# Altium project Flyback181222.PrjPcb
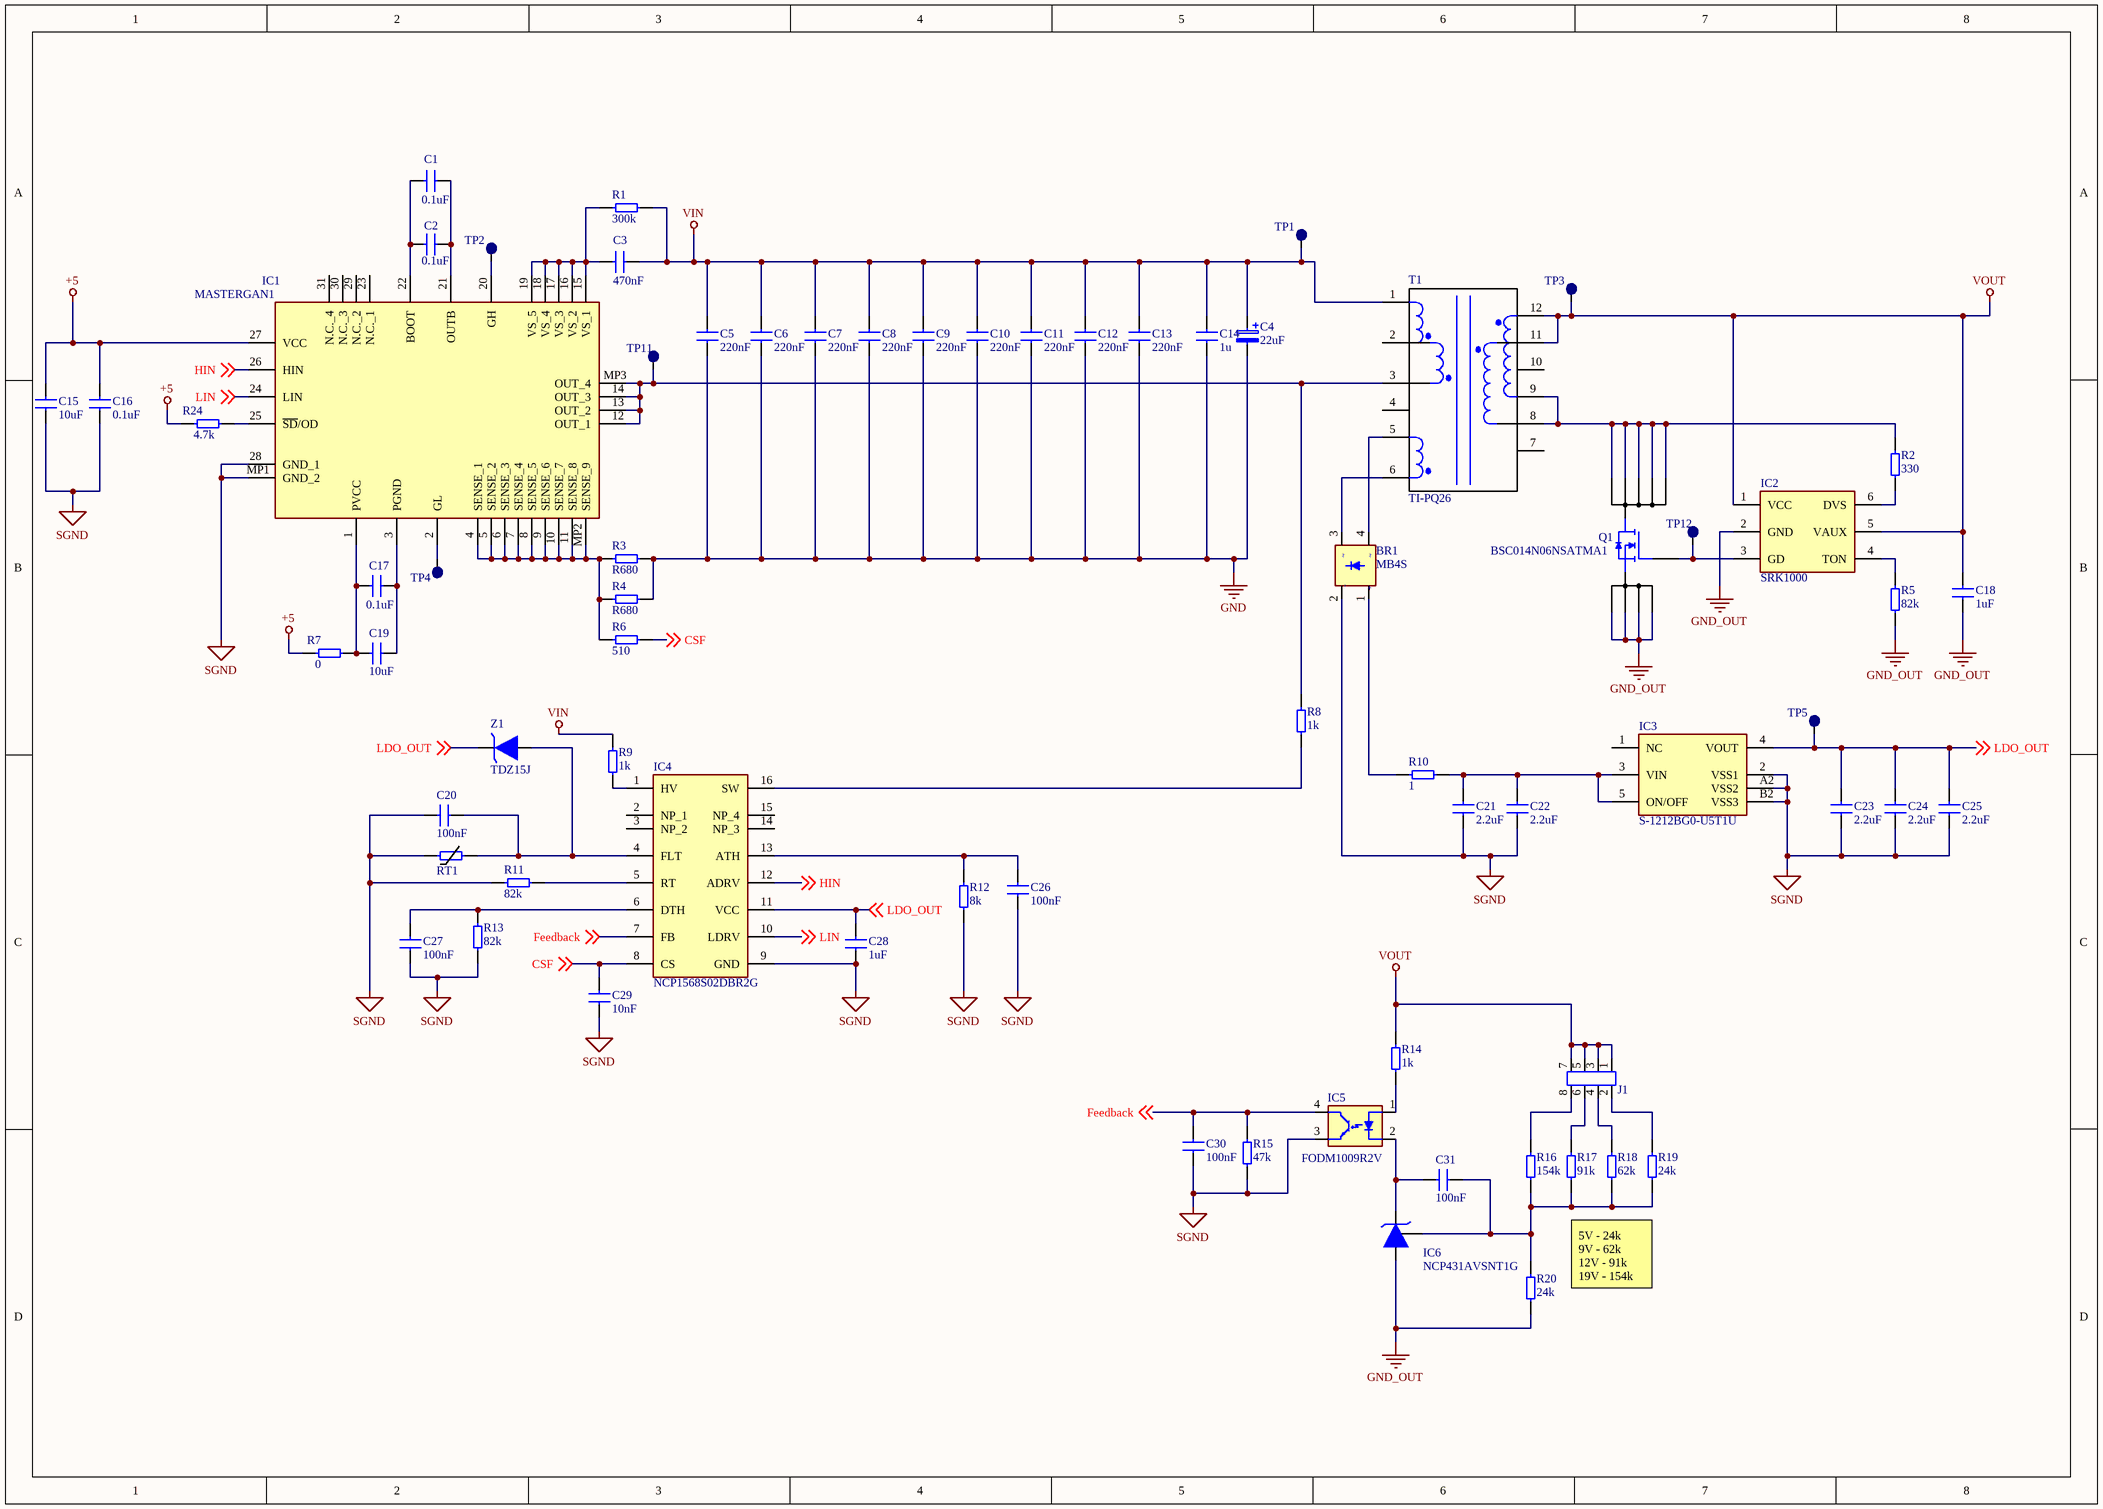
[diagram p0: main.SchDoc]
2 sheets, 102 parts. Net scope: global (net labels, ports and power ports of the same name join across sheets).
Board file: ACF_PCB.PcbDoc
Sheets:
  main.SchDoc
  in_out.SchDoc

## Sheet main.SchDoc
size A3; SheetNumber: 1; SheetTotal: 2; SPICEModelCacheMEYVGTNN: <root> / <DocumentId>MEYVGTNN</DocumentId> / </root>

### Parts
BR1  MB4S  [SOP245P670X290-4N]
C1  0.1uF  [Capcitor_1206]
C2  0.1uF  [Capcitor_1206]
C3  470nF  [Capacitor_1812]
C4  22uF  [CAPPRD500W60D1300H2700]
C5  220nF  [Capacitor_1812]
C6  220nF  [Capacitor_1812]
C7  220nF  [Capacitor_1812]
C8  220nF  [Capacitor_1812]
C9  220nF  [Capacitor_1812]
C10  220nF  [Capacitor_1812]
C11  220nF  [Capacitor_1812]
C12  220nF  [Capacitor_1812]
C13  220nF  [Capacitor_1812]
C14  1u  [TDKB58031]
C15  10uF  [Capcitor_1206]
C16  0.1uF  [Capcitor_1206]
C17  0.1uF  [Capcitor_1206]
C18  1uF  [Capcitor_1206]
C19  10uF  [Capcitor_1206]
C20  100nF  [Capcitor_1206]
C21  2.2uF  [Capcitor_1206]
C22  2.2uF  [Capcitor_1206]
C23  2.2uF  [Capcitor_1206]
C24  2.2uF  [Capcitor_1206]
C25  2.2uF  [Capcitor_1206]
C26  100nF  [Capcitor_1206]
C27  100nF  [Capcitor_1206]
C28  1uF  [Capacitor_0805]
C29  10nF  [Capcitor_1206]
C30  100nF  [Capcitor_1206]
C31  100nF  [Capcitor_1206]
IC1  MASTERGAN1  [MASTERGAN1]
IC2  SRK1000  [SOT95P280X145-6N]
IC3  S-1212BG0-U5T1U  [S1212BG0U5T1U]
IC4  NCP1568S02DBR2G  [SOIC127P600X175-16N]
IC5  FODM1009R2V  [FODM1009R2V]
IC6  NCP431AVSNT1G  [SOT96P237X111-3N]
J1  Header_2x4  [Header_2x4]  (value not drawn)
Q1  BSC014N06NSATMA1  [BSC010N04LS6ATMA1]
R1  300k  [Resistor_1206]
R2  330  [Resistor_1206]
R3  R680  [Resistor_1206]
R4  R680  [Resistor_1206]
R5  82k  [Resistor_1206]
R6  510  [Resistor_1206]
R7  0  [Resistor_0805]
R8  1k  [Resistor_1206]
R9  1k  [Resistor_1206]
R10  1  [Resistor_1206]
R11  82k  [Resistor_1206]
R12  8k  [Resistor_1206]
R13  82k  [Resistor_1206]
R14  1k  [Resistor_1206]
R15  47k  [Resistor_1206]
R16  154k  [Resistor_0805]
R17  91k  [Resistor_0805]
R18  62k  [Resistor_0805]
R19  24k  [Resistor_0805]
R20  24k  [Resistor_1206]
R24  4.7k  [Resistor_0805]
RT1  NTCG104EF104FT1SX  [THRMC1005X55N]  (value not drawn)
T1  TI-PQ26  [PQ26-20-K]
TP1  Test point  [Test point]  (value not drawn)  (no BOM)
TP2  Test point  [Test point]  (value not drawn)  (no BOM)
TP3  Test point  [Test point]  (value not drawn)  (no BOM)
TP4  Test point  [Test point]  (value not drawn)  (no BOM)
TP5  Test point  [Test point]  (value not drawn)  (no BOM)
TP11  Test point  [Test point]  (value not drawn)  (no BOM)
TP12  Test point  [Test point]  (value not drawn)  (no BOM)
Z1  TDZ15J  [SODFL4725X105N]

### Nets
+5: C15.2 C16.1 IC1.27(VCC) R7.1 R24.1
GND: C4.2 C5.1 C6.2 C7.1 C8.2 C9.1 C10.2 C11.2 C12.1 C13.2 C14.2 R3.2 R4.2
GND_OUT: C18.1 IC2.2(GND) IC6.3(A) Q1.1(S_1) Q1.2(S_2) Q1.3(S_3) Q1.10(S_4) R5.1 R20.1
SGND: BR1.2 C15.1 C16.2 C20.1 C21.1 C22.1 C23.1 C24.1 C25.1 C26.1 C27.2 C28.1 C29.2 C30.1 IC1.28(GND_1) IC1.MP1(GND_2) IC3.2(VSS1) IC3.A2(VSS2) IC3.B2(VSS3) IC4.9(GND) IC5.3(E) R11.2 R12.1 R13.2 R15.1 RT1.1
VIN: C3.2 C4.1 C5.2 C6.1 C7.2 C8.1 C9.2 C10.1 C11.1 C12.2 C13.1 C14.1 R1.2 R9.2 T1.1 TP1.1
VOUT: C18.2 IC2.1(VCC) IC2.5(VAUX) J1.1 J1.3 J1.5 J1.7 R14.2 T1.11 T1.12 TP3.1
CSF: C29.1 IC4.8(CS) R6.1 ; off-sheet CSF
Feedback: C30.2 IC4.7(FB) IC5.4(C) R15.2 ; off-sheet Feedback
HIN: IC1.26(HIN) IC4.12(ADRV) ; off-sheet HIN
LDO_OUT: C23.2 C24.2 C25.2 C28.2 IC3.4(VOUT) IC4.11(VCC) TP5.1 Z1.1(K) ; off-sheet LDO_OUT
LIN: IC1.24(LIN) IC4.10(LDRV) ; off-sheet LIN
NetBR1_1: BR1.1 R10.1
NetBR1_3: BR1.3 T1.6
NetBR1_4: BR1.4 T1.5
NetC1_1: C1.1 C2.1 IC1.22(BOOT)
NetC1_2: C1.2 C2.2 IC1.21(OUTB)
NetC3_1: C3.1 IC1.15(VS_1) IC1.16(VS_2) IC1.17(VS_3) IC1.18(VS_4) IC1.19(VS_5) R1.1
NetC17_1: C17.1 C19.1 IC1.1(PVCC) R7.2
NetC17_2: C17.2 C19.2 IC1.3(PGND)
NetC20_2: C20.2 IC4.4(FLT) RT1.2 Z1.2(A)
NetC21_2: C21.2 C22.2 IC3.3(VIN) IC3.5(ON/OFF) R10.2
NetC26_2: C26.2 IC4.13(ATH) R12.2
NetC27_1: C27.1 IC4.6(DTH) R13.1
NetC31_1: C31.1 IC5.2(K) IC6.2(K)
NetC31_2: C31.2 IC6.1(REF) R16.1 R17.1 R18.1 R19.1 R20.2
NetIC1_2: IC1.2(GL) TP4.1
NetIC1_4: IC1.4(SENSE_1) IC1.5(SENSE_2) IC1.6(SENSE_3) IC1.7(SENSE_4) IC1.8(SENSE_5) IC1.9(SENSE_6) IC1.10(SENSE_7) IC1.11(SENSE_8) IC1.MP2(SENSE_9) R3.1 R4.1 R6.2
NetIC1_12: IC1.12(OUT_1) IC1.13(OUT_2) IC1.14(OUT_3) IC1.MP3(OUT_4) R8.2 T1.3 TP11.1
NetIC1_20: IC1.20(GH) TP2.1
NetIC1_25: IC1.25(~{SD}/OD) R24.2
NetIC2_3: IC2.3(GD) Q1.4(G) TP12.1
NetIC2_4: IC2.4(TON) R5.2
NetIC2_6: IC2.6(DVS) R2.1
NetIC4_1: IC4.1(HV) R9.1
NetIC4_5: IC4.5(RT) R11.1
NetIC4_16: IC4.16(SW) R8.1
NetIC5_1: IC5.1(A) R14.1
NetJ1_2: J1.2 R19.2
NetJ1_4: J1.4 R18.2
NetJ1_6: J1.6 R17.2
NetJ1_8: J1.8 R16.2
NetQ1_5: Q1.5(D_1) Q1.6(D_2) Q1.7(D_3) Q1.8(D_4) Q1.9(D_5) R2.2 T1.8 T1.9

Not connected (* = marked no-connect by the designer): IC1 23(N.C._1) 29(N.C._2) 30(N.C._3) 31(N.C._4); IC3 1(NC); IC4 2(NP_1) 3(NP_2) 14(NP_3) 15(NP_4); T1 2 4 7 10

### Notes on the sheet
- 5V - 24k
  9V - 62k
  12V - 91k
  19V - 154k
- (in symbol MB4S) ~; -; +

### Library data of the parts
BR1 = MB4S: Bridge Rectifier; Manufacturer_Name: onsemi; Datasheet Link: http://www.onsemi.com/pub/Collateral/MB8S-D.PDF; Height: 2.9mm; Manufacturer_Part_Number: MB4S; Mouser Part Number: 512-MB4S; Mouser Price/Stock: https://www.mouser.co.uk/ProductDetail/onsemi-Fairchild/MB4S?qs=DPwKKv7J1fyzyqMN%2FwPoFQ%3D%3D; Arrow Part Number: MB4S; Arrow Price/Stock: https://www.arrow.com/en/products/mb4s/on-semiconductor?region=europe
C1 C2 = Capacitor_1206: Capacitor - Standard SMD; Voltage: 25V; Capacitance: 0.1uF; MPN: *
C3 = Capacitor_1812: Capacitor - Standard SMD; MPN: CGA8N4X7T2W474K230KA; Voltage: 450V; Capacitance: 470nF
C4 = Capacitor_Electrolytic_THT: Capacitor - Electrolytic  THT; MPN: ESH226M500AL4AA; Voltage: 500V; Capacitance: 22uF
C5-C13 = Capacitor_1812: Capacitor - Standard SMD; MPN: C1812C224MCRACTU; Voltage: 500; Capacitance: 220nF
C14 = Capacitor_1206: Capacitor - Standard SMD; MPN: 1206B104K451CT; Capacitance: 100nF; Voltage: 450V
C15-C17 C19 = Capacitor_1206: Capacitor - Standard SMD; Voltage: 16V; MPN: *
  C15 C19: Capacitance: 10uF
  C16 C17: Capacitance: 0.1uF
C18 = Capacitor_1206: Capacitor - Standard SMD; MPN: CL31B105KBHNFNE; Voltage: 50; Capacitance: 1uF
C20 C26 C27 C29-C31 = Capacitor_1206: Capacitor - Standard SMD; Voltage: 50V; MPN: *
  C20 C26 C27 C30 C31: Capacitance: 100nF
  C29: Capacitance: 10nF
C21-C25 = Capacitor_1206: Capacitor - Standard SMD; MPN: CL31B225KBHNFNE; Voltage: 50V; Capacitance: 2.2uF
C28 = Capacitor_0805: Capacitor - Standard SMD; Voltage: 25V; Capacitance: 1uF; MPN: *
IC1 = MASTERGAN1: Integrated Circuit; Manufacturer_Name: STMicroelectronics; Datasheet Link: https://www.mouser.com/datasheet/2/389/mastergan1-1893186.pdf; Height: 1mm; Manufacturer_Part_Number: MASTERGAN1; Mouser Part Number: 511-MASTERGAN1; Mouser Price/Stock: https://www.mouser.co.uk/ProductDetail/STMicroelectronics/MASTERGAN1?qs=hWgE7mdIu5TUQlvSzk235A%3D%3D; Arrow Part Number: MASTERGAN1; Arrow Price/Stock: https://www.arrow.com/en/products/mastergan1/stmicroelectronics?region=nac
IC2 = SRK1000: Integrated Circuit; Manufacturer_Name: STMicroelectronics; Datasheet Link: https://www.st.com/resource/en/datasheet/srk1000.pdf; Height: 1.45mm; Manufacturer_Part_Number: SRK1000; Mouser Part Number: 511-SRK1000; Mouser Price/Stock: https://www.mouser.co.uk/ProductDetail/STMicroelectronics/SRK1000?qs=byeeYqUIh0P1pUk%2FLXsjaA%3D%3D; Arrow Part Number: SRK1000; Arrow Price/Stock: https://www.arrow.com/en/products/srk1000/stmicroelectronics
IC3 = S-1212BG0-U5T1U: Integrated Circuit; Manufacturer_Name: ABLIC Inc.; Datasheet Link: https://www.mouser.com/datasheet/2/360/S1212B_D_E-1480071.pdf; Height: 1.6mm; Manufacturer_Part_Number: S-1212BG0-U5T1U; Mouser Part Number: 628-S-1212BG0-U5T1U; Mouser Price/Stock: https://www.mouser.co.uk/ProductDetail/ABLIC/S-1212BG0-U5T1U?qs=PqoDHHvF648vInS7ukjfAw%3D%3D
IC4 = NCP1568S02DBR2G: Integrated Circuit; Manufacturer_Name: onsemi; Datasheet Link: https://datasheet.datasheetarchive.com/originals/distributors/Datasheets_SAMA/e6c73cfd9b14743cc4dd16ca5df3e455.pdf; Height: 1.35mm; Manufacturer_Part_Number: NCP1568S02DBR2G; Mouser Part Number: 863-NCP1568S02DBR2G; Mouser Price/Stock: https://www.mouser.co.uk/ProductDetail/onsemi/NCP1568S02DBR2G?qs=BJlw7L4Cy7%252Bni9d8vX6s0A%3D%3D; Arrow Part Number: NCP1568S02DBR2G; Arrow Price/Stock: https://www.arrow.com/en/products/ncp1568s02dbr2g/on-semiconductor?region=nac
IC5 = FODM1009R2V: Integrated Circuit; Manufacturer_Name: onsemi; Datasheet Link: https://componentsearchengine.com/Datasheets/1/FODM1009R2V.pdf; Height: 2.4mm; Manufacturer_Part_Number: FODM1009R2V; Mouser Part Number: 863-FODM1009R2V; Mouser Price/Stock: https://www.mouser.co.uk/ProductDetail/onsemi/FODM1009R2V?qs=d0WKAl%252BL4Kbb4VetG0t5Tw%3D%3D; Arrow Part Number: FODM1009R2V; Arrow Price/Stock: https://www.arrow.com/en/products/fodm1009r2v/on-semiconductor?region=nac
IC6 = NCP431AVSNT1G: Programmable Precision / Reference; Manufacturer_Name: onsemi; Datasheet Link: http://www.onsemi.com/pub/Collateral/NCP431-D.PDF; Height: 1.11mm; Manufacturer_Part_Number: NCP431AVSNT1G; Mouser Part Number: 863-NCP431AVSNT1G; Mouser Price/Stock: https://www.mouser.com/Search/Refine.aspx?Keyword=863-NCP431AVSNT1G; Arrow Part Number: NCP431AVSNT1G; Arrow Price/Stock: https://www.arrow.com/en/products/ncp431avsnt1g/on-semiconductor
Q1 = BSC014N06NSATMA1: MOSFET (N-Channel); Manufacturer_Name: Infineon; Datasheet Link: http://www.farnell.com/datasheets/1849651.html; Height: 1.1mm; Manufacturer_Part_Number: BSC014N06NSATMA1; Mouser Part Number: 726-BSC014N06NSATMA1; Mouser Price/Stock: https://www.mouser.co.uk/ProductDetail/Infineon-Technologies/BSC014N06NSATMA1?qs=K00xGehIljshgUA78G26tg%3D%3D; Arrow Part Number: BSC014N06NSATMA1; Arrow Price/Stock: https://www.arrow.com/en/products/bsc014n06nsatma1/infineon-technologies-ag
R1 R2 R5 R6 R8-R15 R20 = Resistor_1206: Resistor - Standard SMD
  R1: Resistance: 300k
  R2: Resistance: 330; Power rate: *; MPN: *
  R5 R11 R13: Resistance: 82k; Power rate: *; MPN: *
  R6: Resistance: 510; Power rate: *; MPN: *
  R8 R9 R14: Resistance: 1k; Power rate: *; MPN: *
  R10: Resistance: 1; Power rate: *; MPN: *
  R12: Resistance: 8k; Power rate: *; MPN: *
  R15: Resistance: 47k; Power rate: *; MPN: *
  R20: Resistance: 24k; Power rate: *; MPN: *
R3 R4 = Resistor_1206: Resistor - Standard SMD; MPN: PE1206FRF7W0R68L; Power rate: 0.5 W; Resistance: R680
R7 R16-R19 R24 = Resistor_0805: Resistor - Standard SMD; Power rate: *; MPN: *
  R7: Resistance: 0
  R16: Resistance: 154k
  R17: Resistance: 91k
  R18: Resistance: 62k
  R19: Resistance: 24k
  R24: Resistance: 4.7k
RT1 = NTCG104EF104FT1SX: Thermistor; Manufacturer_Name: TDK; Datasheet Link: https://product.tdk.com/system/files/dam/doc/product/sensor/ntc/chip-ntc-thermistor/catalog/tpd_automotive_ntc-thermistor_ntcg_en.pdf; Height: 0.55mm; Manufacturer_Part_Number: NTCG104EF104FT1SX; Mouser Part Number: 810-NTC104EF104FT1SX; Mouser Price/Stock: https://www.mouser.co.uk/ProductDetail/TDK/NTCG104EF104FT1SX?qs=cNoPOocMWw25zdFQn%252B2tmg%3D%3D; Arrow Part Number: NTCG104EF104FT1SX; Arrow Price/Stock: https://www.arrow.com/en/products/ntcg104ef104ft1sx/tdk
T1 = TI-PQ26: Transformer; MPN: TI-PQ26/20-EPR11; Value: TI-PQ26; HelpURL: https://dokumentacja.feryster.pl/rysuj.php?indeks=76996816298acf4170f50a7b81faccb4
Z1 = TDZ15J: Zener Diode; Manufacturer_Name: Nexperia; Datasheet Link: https://assets.nexperia.com/documents/data-sheet/TDZXJ_SER.pdf; Height: 0.8mm; Manufacturer_Part_Number: TDZ15J; Mouser Price/Stock: https://www.mouser.co.uk/ProductDetail/Nexperia/TDZ3V3J115?qs=A1cBxND5mHI2cVlA%2FVFCtg%3D%3D; Arrow Part Number: TDZ3V3J,115; Arrow Price/Stock: https://www.arrow.com/en/products/tdz3v3j115/nexperia
J1 = Header_2x4: HelpURL: *; MPN: *

## Sheet in_out.SchDoc
size A3; SheetNumber: 2; SheetTotal: 2; SPICEModelCacheBOWUJFQP: <root> / <DocumentId>BOWUJFQP</DocumentId> / </root>
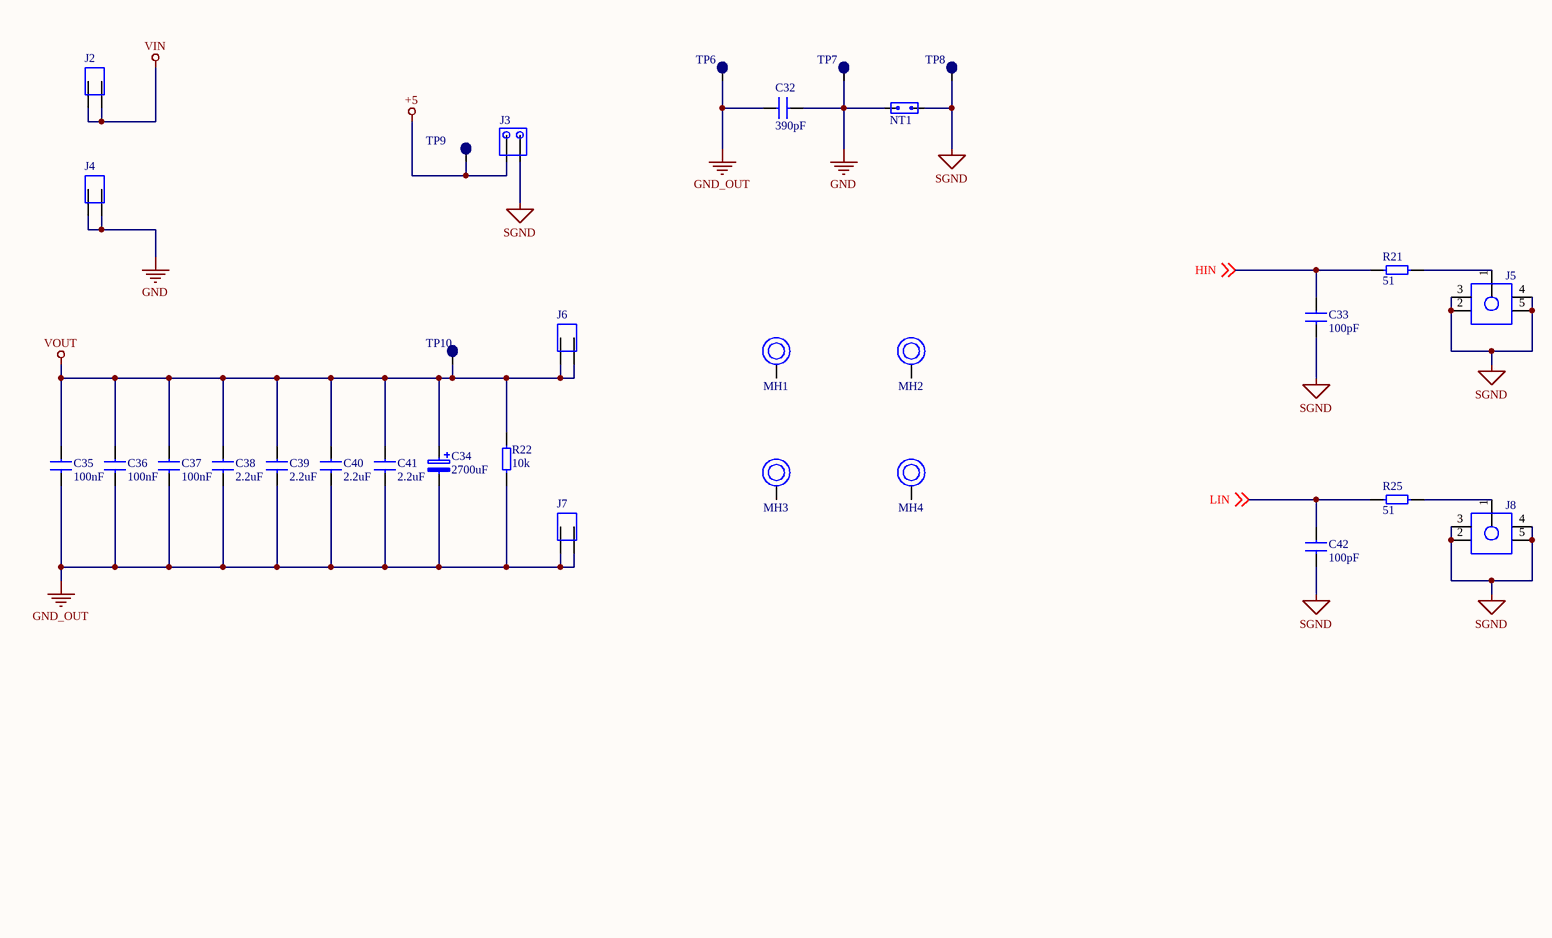
[diagram p1: in_out.SchDoc]

### Parts
C32  390pF  [Capacitor_1812]
C33  100pF  [Capacitor_0805]
C34  2700uF  [Capacitor_Electrolytic_Vib_Res]
C35  100nF  [Capacitor_0805]
C36  100nF  [Capacitor_0805]
C37  100nF  [Capacitor_0805]
C38  2.2uF  [Capcitor_1206]
C39  2.2uF  [Capcitor_1206]
C40  2.2uF  [Capcitor_1206]
C41  2.2uF  [Capcitor_1206]
C42  100pF  [Capacitor_0805]
J2  1289-STR  [1289STR]  (value not drawn)
J3  Connector_3.5mm  [Connector_3.5]  (value not drawn)
J4  1289-STR  [1289STR]  (value not drawn)
J5  142-0701-301  [1420701301]  (value not drawn)
J6  1289-STR  [1289STR]  (value not drawn)
J7  1289-STR  [1289STR]  (value not drawn)
J8  142-0701-301  [1420701301]  (value not drawn)
MH1  Mounting_Hole_M3  [Mounting_Hole_M3]  (value not drawn)  (no BOM)
MH2  Mounting_Hole_M3  [Mounting_Hole_M3]  (value not drawn)  (no BOM)
MH3  Mounting_Hole_M3  [Mounting_Hole_M3]  (value not drawn)  (no BOM)
MH4  Mounting_Hole_M3  [Mounting_Hole_M3]  (value not drawn)  (no BOM)
NT1  Net tie  [Net tie]  (value not drawn)  (net tie, no BOM)
R21  51  [Resistor_0805]
R22  10k  [Resistor_1206]
R25  51  [Resistor_0805]
TP6  Test point  [Test point]  (value not drawn)  (no BOM)
TP7  Test point  [Test point]  (value not drawn)  (no BOM)
TP8  Test point  [Test point]  (value not drawn)  (no BOM)
TP9  Test point  [Test point]  (value not drawn)  (no BOM)
TP10  Test point  [Test point]  (value not drawn)  (no BOM)

### Nets
+5: J3.2 TP9.1
GND: C32.2 J4.1 J4.2 NT1.1 TP7.1
GND_OUT: C32.1 C34.2 C35.1 C36.1 C37.1 C38.1 C39.1 C40.1 C41.1 J7.1 J7.2 R22.1 TP6.1
SGND: C33.1 C42.1 J3.1 J5.2 J5.3 J5.4 J5.5 J8.2 J8.3 J8.4 J8.5 NT1.2 TP8.1
VIN: J2.1 J2.2
VOUT: C34.1 C35.2 C36.2 C37.2 C38.2 C39.2 C40.2 C41.2 J6.1 J6.2 R22.2 TP10.1
HIN: C33.2 R21.1 ; off-sheet HIN
LIN: C42.2 R25.1 ; off-sheet LIN
NetJ5_1: J5.1 R21.2
NetJ8_1: J8.1 R25.2

Not connected (* = marked no-connect by the designer): MH1 1; MH2 1; MH3 1; MH4 1

### Library data of the parts
C32 = Capacitor_1812: Capacitor - Standard SMD; MPN: 1812B391K202CT; Voltage: 2kV; Capacitance: 390pF
C33 C42 = Capacitor_0805: Capacitor - Standard SMD; Voltage: 12V; Capacitance: 100pF; MPN: *
C34 = Capacitor_Electrolytic_Vib_Res: Capacitor - Electrolytic  SMD; Voltage: 35V; Capacitance: 2700uF; MPN: *
C35-C37 = Capacitor_0805: Capacitor - Standard SMD; MPN: CL21B104KBCNNND; Voltage: 50V; Capacitance: 100nF
C38-C41 = Capacitor_1206: as C21 on sheet main; Capacitance: 2.2uF
J2 J4 J6 J7 = 1289-STR: Connector; Manufacturer_Name: Keystone Electronics; Datasheet Link: https://www.mouser.com/datasheet/2/215/Keystone_Electronics_12182018_1289-ST-1510776.pdf; Height: 14.37mm; Manufacturer_Part_Number: 1289-STR; Mouser Part Number: 534-1289-STR; Mouser Price/Stock: https://www.mouser.co.uk/ProductDetail/Keystone-Electronics/1289-STR?qs=0lSvoLzn4L%252BMUIbPVNHg8g%3D%3D
J5 J8 = 142-0701-301: Connector; Manufacturer_Name: Cinch Connectivity Solutions; Arrow Price/Stock: https://www.arrow.com/en/products/142-0701-301/cinch-connectivity-solutions?region=nac; Source: KN_ECART.SchLib; Design Item ID: 142-0701-301; Datasheet Link: https://datasheet.datasheetarchive.com/originals/distributors/Datasheets_SAMA/2ec9b041f970d014d2778887508fd87c.pdf; Height: 9.779mm; Mouser Price/Stock: https://www.mouser.co.uk/ProductDetail/Johnson-Cinch-Connectivity-Solutions/142-0701-301?qs=VqHsQWpF6un5h9kBF%252BTxDw%3D%3D; Mouser Part Number: 530-142-0701-301; Manufacturer_Part_Number: 142-0701-301; Arrow Part Number: 142-0701-301
R21 R25 = Resistor_0805: Resistor - Standard SMD; Resistance: 51; Power rate: *; MPN: *
R22 = Resistor_1206: Resistor - Standard SMD; Resistance: 10k; Power rate: *; MPN: *
J3 = Connector_3.5mm: Value: *; HelpURL: *; MPN: *

## Nets that join several sheets
+5: main (5 pins), in_out (J3.2 TP9.1)
GND: main (13 pins), in_out (5 pins)
GND_OUT: main (9 pins), in_out (13 pins)
SGND: main (26 pins), in_out (13 pins)
VIN: main (16 pins), in_out (J2.1 J2.2)
VOUT: main (11 pins), in_out (12 pins)
HIN: main (IC1.26 IC4.12), in_out (C33.2 R21.1)
LIN: main (IC1.24 IC4.10), in_out (C42.2 R25.1)